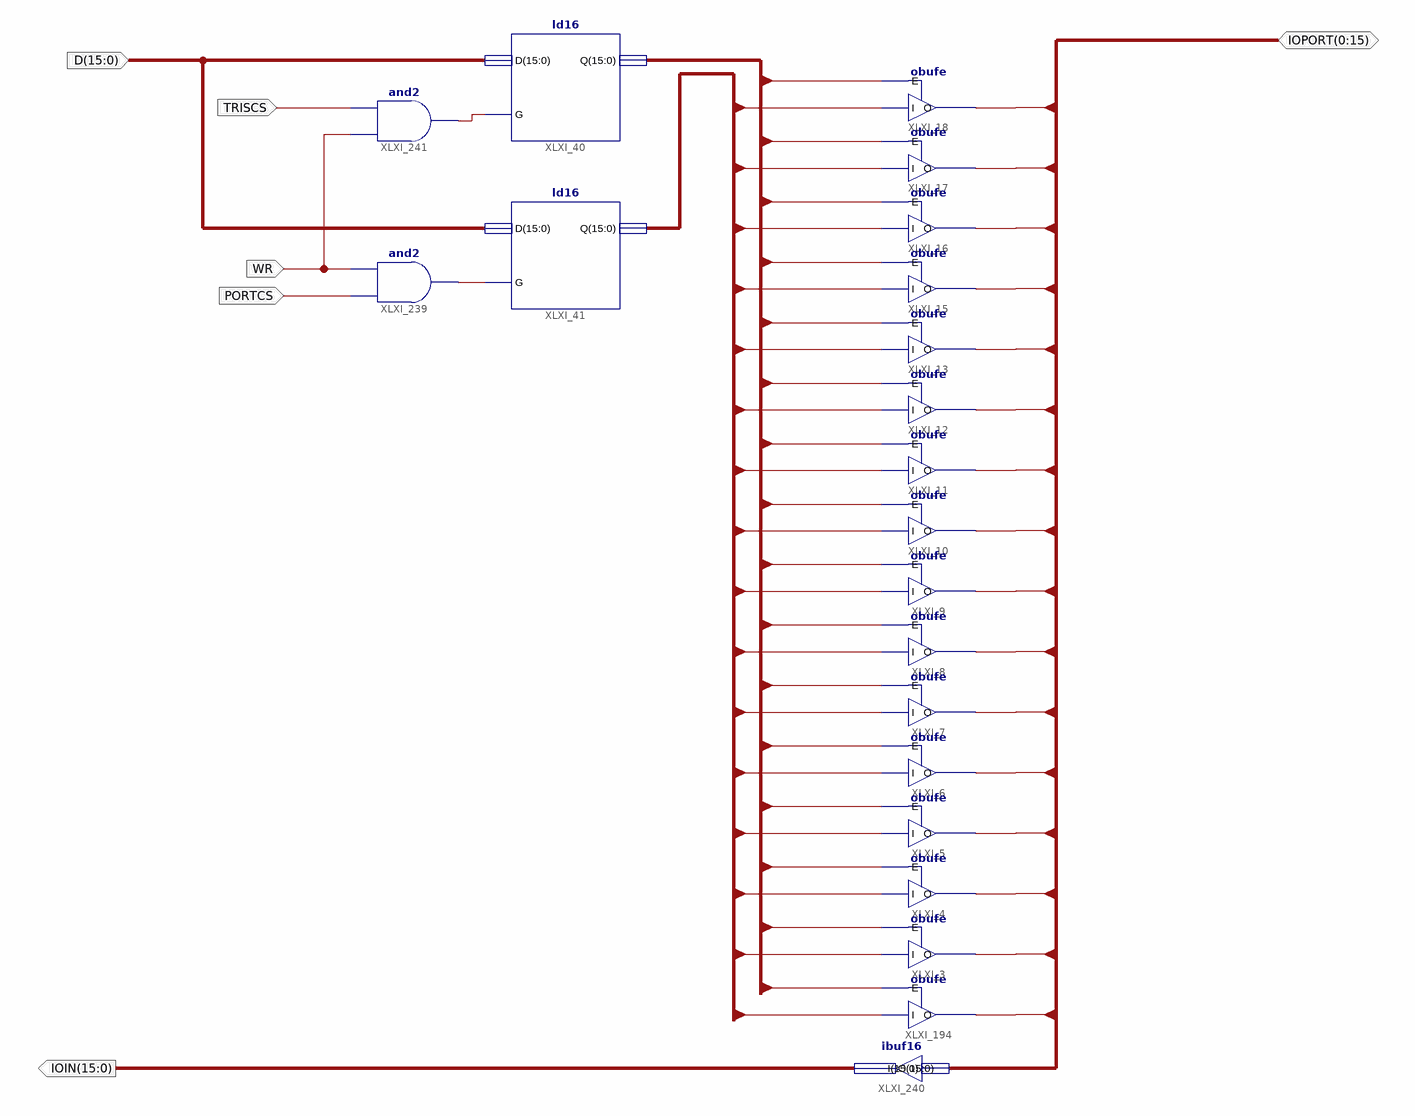
[diagram p0: schematic sheet 1]
// Xilinx ISE schematic ioport.sch (xc9500) as structural Verilog: 21 symbols, 6 ports
module ioport (
  input  WR,
  input  PORTCS,
  input  TRISCS,
  input  [15:0] D,
  inout  [0:15] IOPORT,
  output [15:0] IOIN
);

  wire XLXN_171, XLXN_173;
  wire [15:0] PORTAQ, TRISAQ;

  ld16 XLXI_41 (.D(D), .G(XLXN_171), .Q(PORTAQ));
  ld16 XLXI_40 (.D(D), .G(XLXN_173), .Q(TRISAQ));
  obufe XLXI_194 (.E(TRISAQ[15]), .I(PORTAQ[15]), .O(IOPORT[15]));
  obufe XLXI_18 (.E(TRISAQ[0]), .I(PORTAQ[0]), .O(IOPORT[0]));
  obufe XLXI_17 (.E(TRISAQ[1]), .I(PORTAQ[1]), .O(IOPORT[1]));
  obufe XLXI_16 (.E(TRISAQ[2]), .I(PORTAQ[2]), .O(IOPORT[2]));
  obufe XLXI_15 (.E(TRISAQ[3]), .I(PORTAQ[3]), .O(IOPORT[3]));
  obufe XLXI_13 (.E(TRISAQ[4]), .I(PORTAQ[4]), .O(IOPORT[4]));
  obufe XLXI_12 (.E(TRISAQ[5]), .I(PORTAQ[5]), .O(IOPORT[5]));
  obufe XLXI_11 (.E(TRISAQ[6]), .I(PORTAQ[6]), .O(IOPORT[6]));
  obufe XLXI_10 (.E(TRISAQ[7]), .I(PORTAQ[7]), .O(IOPORT[7]));
  obufe XLXI_9 (.E(TRISAQ[8]), .I(PORTAQ[8]), .O(IOPORT[8]));
  obufe XLXI_8 (.E(TRISAQ[9]), .I(PORTAQ[9]), .O(IOPORT[9]));
  obufe XLXI_7 (.E(TRISAQ[10]), .I(PORTAQ[10]), .O(IOPORT[10]));
  obufe XLXI_6 (.E(TRISAQ[11]), .I(PORTAQ[11]), .O(IOPORT[11]));
  obufe XLXI_5 (.E(TRISAQ[12]), .I(PORTAQ[12]), .O(IOPORT[12]));
  obufe XLXI_4 (.E(TRISAQ[13]), .I(PORTAQ[13]), .O(IOPORT[13]));
  obufe XLXI_3 (.E(TRISAQ[14]), .I(PORTAQ[14]), .O(IOPORT[14]));
  and XLXI_239 (XLXN_171, PORTCS, WR);
  ibuf16 XLXI_240 (.I(IOPORT), .O(IOIN));
  and XLXI_241 (XLXN_173, WR, TRISCS);
endmodule
